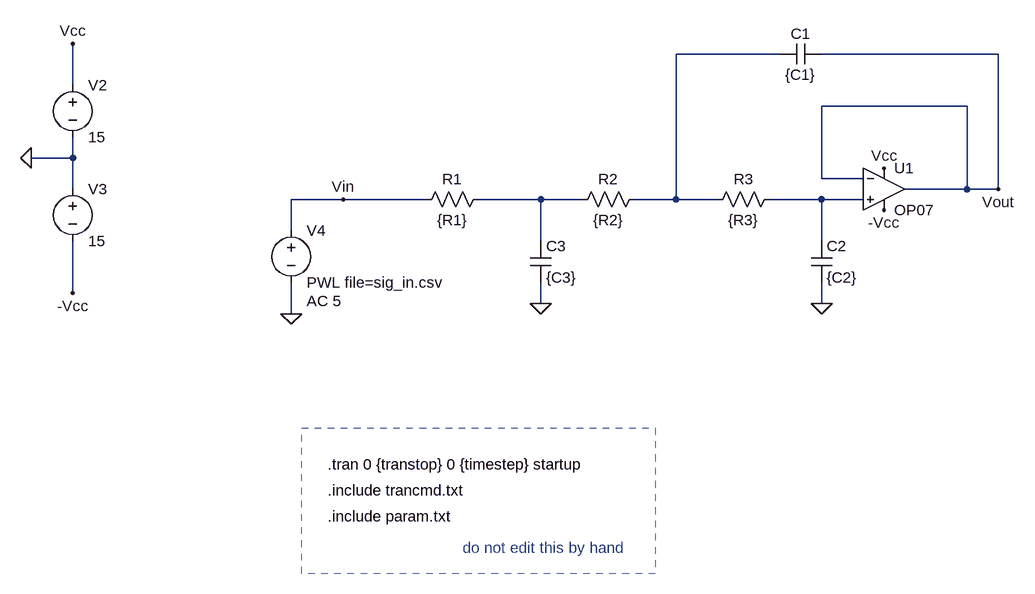
[diagram p0: schematic A5_BajaSK_3.asc]
A5_BajaSK_3.asc, the LTspice schematic file:
Version 4
SHEET 1 2492 680
WIRE 2112 -464 1952 -464
WIRE 2448 -464 2176 -464
WIRE 1024 -416 1024 -480
WIRE 2400 -384 2176 -384
WIRE 1024 -304 1024 -336
WIRE 1024 -304 960 -304
WIRE 2176 -272 2176 -384
WIRE 2240 -272 2176 -272
WIRE 1024 -256 1024 -304
WIRE 2400 -256 2400 -384
WIRE 2400 -256 2304 -256
WIRE 2448 -256 2448 -464
WIRE 2448 -256 2400 -256
WIRE 1440 -240 1360 -240
WIRE 1568 -240 1440 -240
WIRE 1744 -240 1648 -240
WIRE 1808 -240 1744 -240
WIRE 1952 -240 1952 -464
WIRE 1952 -240 1888 -240
WIRE 2016 -240 1952 -240
WIRE 2176 -240 2096 -240
WIRE 2240 -240 2176 -240
WIRE 1360 -192 1360 -240
WIRE 1744 -176 1744 -240
WIRE 2176 -176 2176 -240
WIRE 1024 -96 1024 -176
WIRE 1744 -80 1744 -112
WIRE 2176 -80 2176 -112
WIRE 1360 -64 1360 -112
FLAG 2448 -256 Vout
FLAG 2176 -80 0
FLAG 1440 -240 Vin
FLAG 960 -304 0
FLAG 1024 -480 Vcc
FLAG 1024 -96 -Vcc
FLAG 2272 -288 Vcc
FLAG 2272 -224 -Vcc
FLAG 1360 -64 0
FLAG 1744 -80 0
SYMBOL res 1664 -256 R90
WINDOW 0 0 56 VBottom 2
WINDOW 3 32 56 VTop 2
SYMATTR InstName R1
SYMATTR Value {R1}
SYMBOL cap 2112 -448 R270
WINDOW 0 32 32 VTop 2
WINDOW 3 0 32 VBottom 2
SYMATTR InstName C1
SYMATTR Value {C1}
SYMBOL OpAmps\\OP07 2272 -320 R0
SYMATTR InstName U1
SYMBOL cap 2160 -176 R0
SYMATTR InstName C2
SYMATTR Value {C2}
SYMBOL voltage 1024 -432 R0
WINDOW 123 0 0 Left 0
WINDOW 39 0 0 Left 0
SYMATTR InstName V2
SYMATTR Value 15
SYMBOL voltage 1024 -272 R0
WINDOW 123 0 0 Left 0
WINDOW 39 0 0 Left 0
SYMATTR InstName V3
SYMATTR Value 15
SYMBOL voltage 1360 -208 R0
WINDOW 123 24 124 Left 2
WINDOW 39 0 0 Left 0
SYMATTR Value2 AC 5
SYMATTR InstName V4
SYMATTR Value PWL file=sig_in.csv
SYMBOL res 1904 -256 R90
WINDOW 0 0 56 VBottom 2
WINDOW 3 32 56 VTop 2
SYMATTR InstName R2
SYMATTR Value {R2}
SYMBOL res 2112 -256 R90
WINDOW 0 0 56 VBottom 2
WINDOW 3 32 56 VTop 2
SYMATTR InstName R3
SYMATTR Value {R3}
SYMBOL cap 1728 -176 R0
SYMATTR InstName C3
SYMATTR Value {C3}
TEXT 1416 168 Left 2 !.tran 0 {transtop} 0 {timestep} startup
TEXT 1416 248 Left 2 !.include param.txt
TEXT 1416 208 Left 2 !.include trancmd.txt
TEXT 1624 296 Left 2 ;do not edit this by hand
RECTANGLE Normal 1920 336 1376 112 2

The netlist it stands for:
* A5_BajaSK_3.asc
R1 N002 Vin {R1}
C1 N001 Vout {C1}
XU1 N003 Vout Vcc -Vcc Vout LT1001  ; OP07, pins In+ In- V+ V- OUT
C2 N003 0 {C2}
V2 Vcc 0 15
V3 0 -Vcc 15
V4 Vin 0 PWL file=sig_in.csv AC 5
R2 N001 N002 {R2}
R3 N003 N001 {R3}
C3 N002 0 {C3}
.tran 0 {transtop} 0 {timestep} startup
.include param.txt
.include trancmd.txt
* do not edit this by hand
.lib LTC.lib
.backanno
.end

* Results of the author's LTspice run, read from the files saved beside the schematic
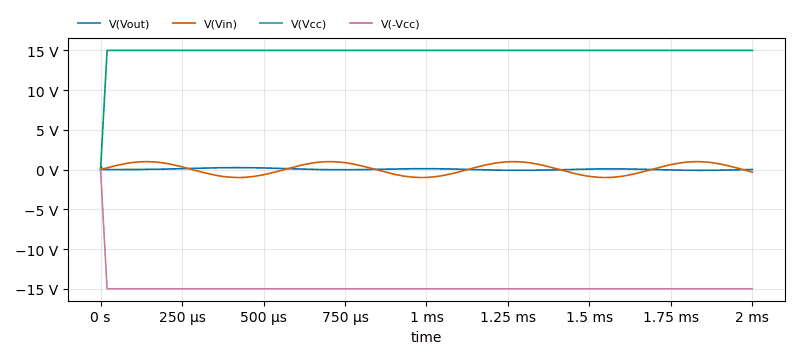
[diagram p1: Transient Analysis of A5_BajaSK_3.asc, plotted from the saved traces]
* Transient Analysis, 1 run:
*   V(Vout): min -96.66 mV, max 356.5 mV, average 41.17 mV, rms 100.7 mV, last 14.78 mV
*   V(Vin): min -1 V, max 999.7 mV, average 87.21 mV, rms 701.6 mV, last -319.2 mV
*   V(Vcc): min 0 V, max 15 V, average 14.92 V, rms 14.95 V, last 15 V
*   V(-Vcc): min -15 V, max 0 V, average -14.92 V, rms 14.95 V, last -15 V